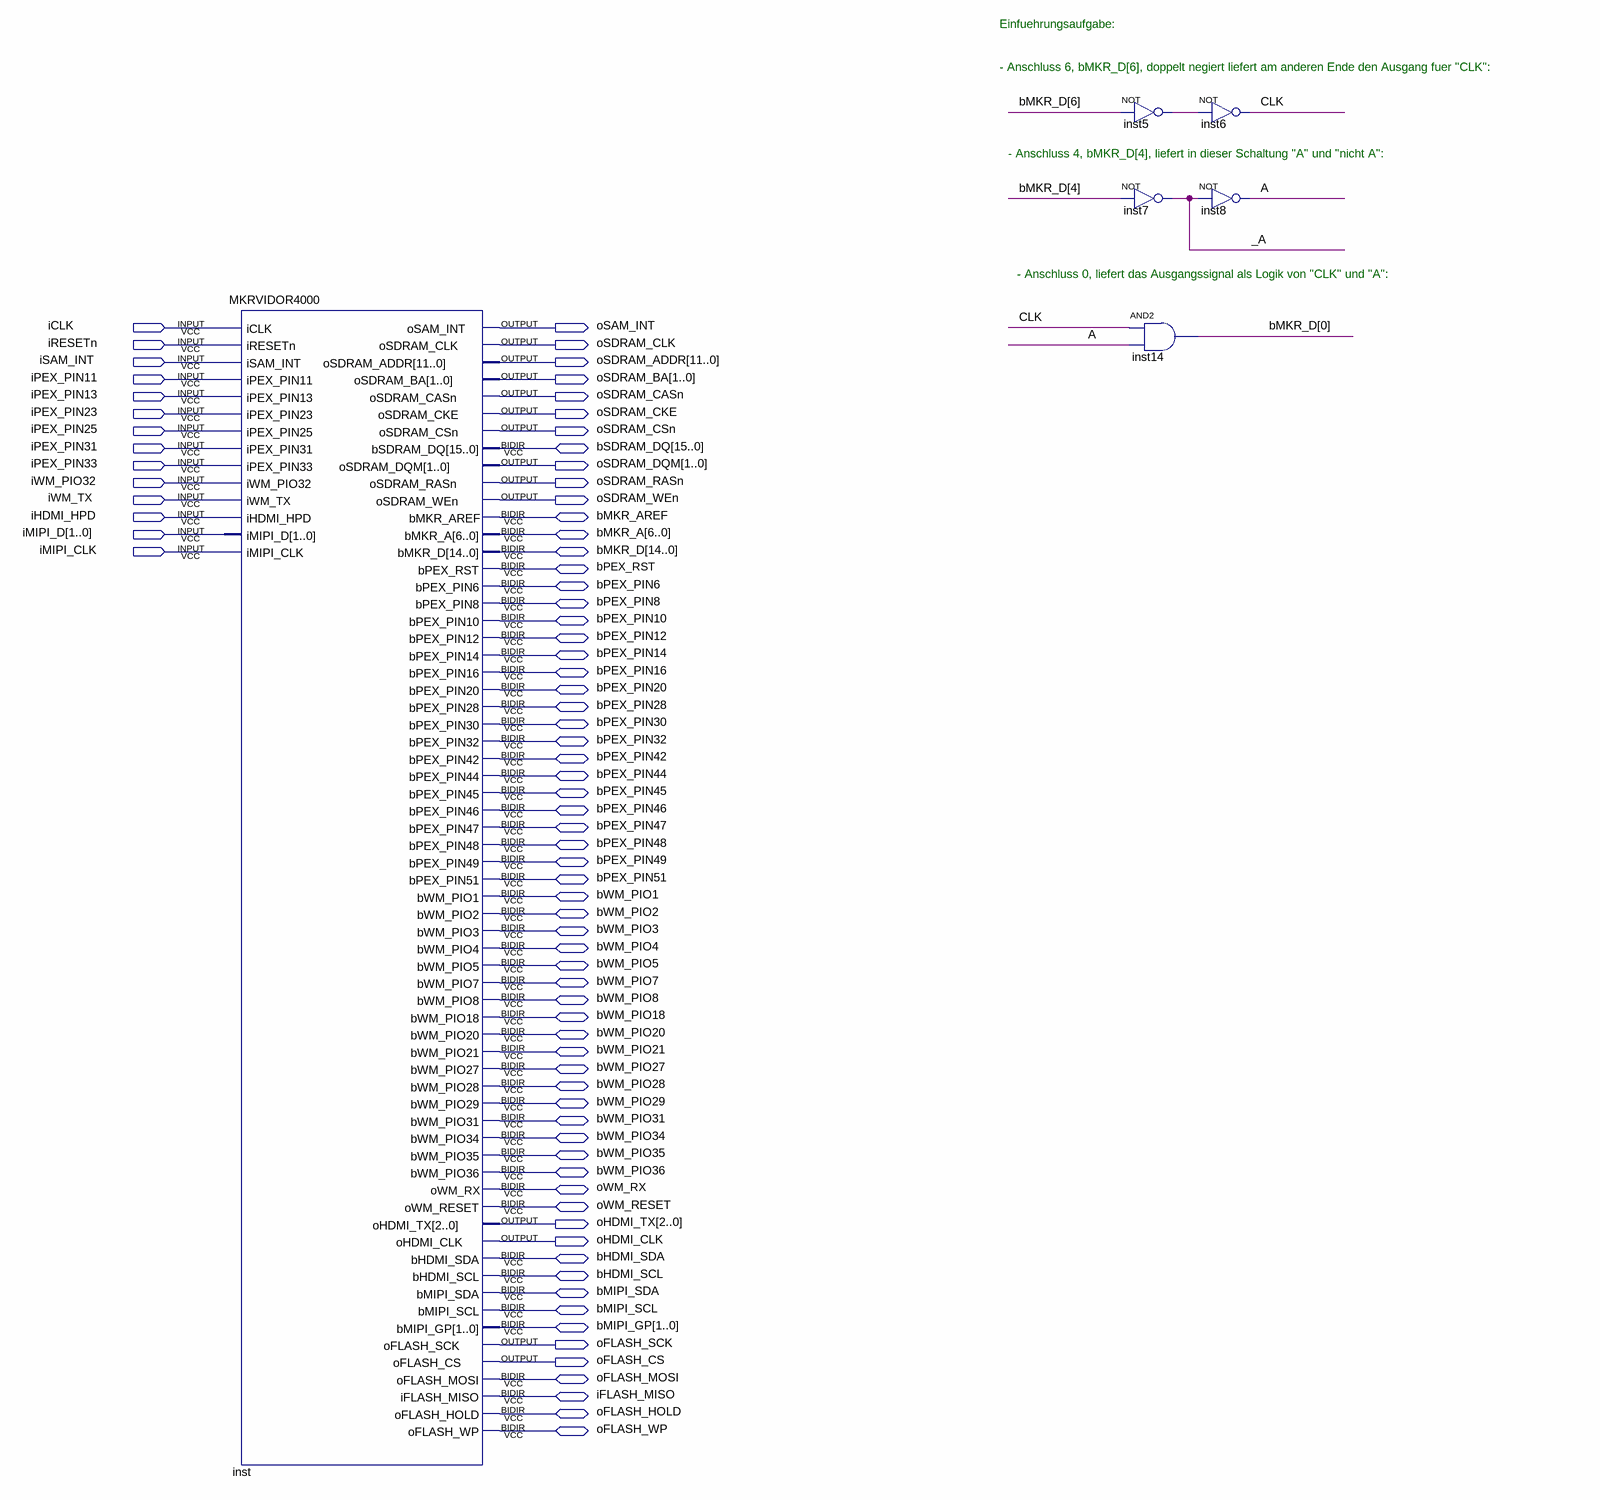
[diagram p0: schematic sheet]
// Quartus schematic FHS_DIG_Schematic.bdf as structural Verilog: 6 symbols, 79 pins
module FHS_DIG_Schematic (
  input  iCLK,
  input  iRESETn,
  input  iSAM_INT,
  input  iPEX_PIN11,
  input  iPEX_PIN13,
  input  iPEX_PIN23,
  input  iPEX_PIN25,
  input  iPEX_PIN31,
  input  iPEX_PIN33,
  input  iWM_PIO32,
  input  iWM_TX,
  input  iHDMI_HPD,
  input  [1:0] iMIPI_D,
  input  iMIPI_CLK,
  inout  [15:0] bSDRAM_DQ,
  inout  bMKR_AREF,
  inout  [6:0] bMKR_A,
  inout  [14:0] bMKR_D,
  inout  bPEX_RST,
  inout  bPEX_PIN6,
  inout  bPEX_PIN8,
  inout  bPEX_PIN10,
  inout  bPEX_PIN12,
  inout  bPEX_PIN14,
  inout  bPEX_PIN16,
  inout  bPEX_PIN20,
  inout  bPEX_PIN28,
  inout  bPEX_PIN30,
  inout  bPEX_PIN32,
  inout  bPEX_PIN42,
  inout  bPEX_PIN44,
  inout  bPEX_PIN45,
  inout  bPEX_PIN46,
  inout  bPEX_PIN47,
  inout  bPEX_PIN48,
  inout  bPEX_PIN49,
  inout  bPEX_PIN51,
  inout  bWM_PIO1,
  inout  bWM_PIO2,
  inout  bWM_PIO3,
  inout  bWM_PIO4,
  inout  bWM_PIO5,
  inout  bWM_PIO7,
  inout  bWM_PIO8,
  inout  bWM_PIO18,
  inout  bWM_PIO20,
  inout  bWM_PIO21,
  inout  bWM_PIO27,
  inout  bWM_PIO28,
  inout  bWM_PIO29,
  inout  bWM_PIO31,
  inout  bWM_PIO34,
  inout  bWM_PIO35,
  inout  bWM_PIO36,
  inout  oWM_RX,
  inout  oWM_RESET,
  inout  bHDMI_SDA,
  inout  bHDMI_SCL,
  inout  bMIPI_SDA,
  inout  bMIPI_SCL,
  inout  [1:0] bMIPI_GP,
  inout  oFLASH_MOSI,
  inout  iFLASH_MISO,
  inout  oFLASH_HOLD,
  inout  oFLASH_WP,
  output oSAM_INT,
  output oSDRAM_CLK,
  output [11:0] oSDRAM_ADDR,
  output [1:0] oSDRAM_BA,
  output oSDRAM_CASn,
  output oSDRAM_CKE,
  output oSDRAM_CSn,
  output [1:0] oSDRAM_DQM,
  output oSDRAM_RASn,
  output oSDRAM_WEn,
  output [2:0] oHDMI_TX,
  output oHDMI_CLK,
  output oFLASH_SCK,
  output oFLASH_CS
);

  wire _A, A, CLK, inst5_out;

  MKRVIDOR4000 inst (
    .iCLK(iCLK), .iRESETn(iRESETn), .iSAM_INT(iSAM_INT), .iPEX_PIN11(iPEX_PIN11), .iPEX_PIN13(iPEX_PIN13),
    .iPEX_PIN23(iPEX_PIN23), .iPEX_PIN25(iPEX_PIN25), .iPEX_PIN31(iPEX_PIN31), .iPEX_PIN33(iPEX_PIN33),
    .iWM_PIO32(iWM_PIO32), .iWM_TX(iWM_TX), .iHDMI_HPD(iHDMI_HPD), .iMIPI_D(iMIPI_D), .iMIPI_CLK(iMIPI_CLK),
    .oSAM_INT(oSAM_INT), .oSDRAM_CLK(oSDRAM_CLK), .oSDRAM_ADDR(oSDRAM_ADDR), .oSDRAM_BA(oSDRAM_BA),
    .oSDRAM_CASn(oSDRAM_CASn), .oSDRAM_CKE(oSDRAM_CKE), .oSDRAM_CSn(oSDRAM_CSn), .oSDRAM_DQM(oSDRAM_DQM),
    .oSDRAM_RASn(oSDRAM_RASn), .oSDRAM_WEn(oSDRAM_WEn), .oHDMI_TX(oHDMI_TX), .oHDMI_CLK(oHDMI_CLK),
    .oFLASH_SCK(oFLASH_SCK), .oFLASH_CS(oFLASH_CS), .bSDRAM_DQ(bSDRAM_DQ), .bMKR_AREF(bMKR_AREF),
    .bMKR_A(bMKR_A), .bMKR_D(bMKR_D), .bPEX_RST(bPEX_RST), .bPEX_PIN6(bPEX_PIN6), .bPEX_PIN8(bPEX_PIN8),
    .bPEX_PIN10(bPEX_PIN10), .bPEX_PIN12(bPEX_PIN12), .bPEX_PIN14(bPEX_PIN14), .bPEX_PIN16(bPEX_PIN16),
    .bPEX_PIN20(bPEX_PIN20), .bPEX_PIN28(bPEX_PIN28), .bPEX_PIN30(bPEX_PIN30), .bPEX_PIN32(bPEX_PIN32),
    .bPEX_PIN42(bPEX_PIN42), .bPEX_PIN44(bPEX_PIN44), .bPEX_PIN45(bPEX_PIN45), .bPEX_PIN46(bPEX_PIN46),
    .bPEX_PIN47(bPEX_PIN47), .bPEX_PIN48(bPEX_PIN48), .bPEX_PIN49(bPEX_PIN49), .bPEX_PIN51(bPEX_PIN51),
    .bWM_PIO1(bWM_PIO1), .bWM_PIO2(bWM_PIO2), .bWM_PIO3(bWM_PIO3), .bWM_PIO4(bWM_PIO4), .bWM_PIO5(bWM_PIO5),
    .bWM_PIO7(bWM_PIO7), .bWM_PIO8(bWM_PIO8), .bWM_PIO18(bWM_PIO18), .bWM_PIO20(bWM_PIO20),
    .bWM_PIO21(bWM_PIO21), .bWM_PIO27(bWM_PIO27), .bWM_PIO28(bWM_PIO28), .bWM_PIO29(bWM_PIO29),
    .bWM_PIO31(bWM_PIO31), .bWM_PIO34(bWM_PIO34), .bWM_PIO35(bWM_PIO35), .bWM_PIO36(bWM_PIO36),
    .oWM_RX(oWM_RX), .oWM_RESET(oWM_RESET), .bHDMI_SDA(bHDMI_SDA), .bHDMI_SCL(bHDMI_SCL),
    .bMIPI_SDA(bMIPI_SDA), .bMIPI_SCL(bMIPI_SCL), .bMIPI_GP(bMIPI_GP), .oFLASH_MOSI(oFLASH_MOSI),
    .iFLASH_MISO(iFLASH_MISO), .oFLASH_HOLD(oFLASH_HOLD), .oFLASH_WP(oFLASH_WP));
  not inst5 (inst5_out, bMKR_D[6]);
  not inst7 (_A, bMKR_D[4]);
  and inst14 (bMKR_D[0], CLK, A);
  not inst6 (CLK, inst5_out);
  not inst8 (A, _A);

  // Notes on the sheet:
  //   Einfuehrungsaufgabe:
  //   - Anschluss 6, bMKR_D[6], doppelt negiert liefert am anderen Ende den Ausgang fuer "CLK":
  //   - Anschluss 4, bMKR_D[4], liefert in dieser Schaltung "A" und "nicht A":
  //   - Anschluss 0, liefert das Ausgangssignal als Logik von "CLK" und "A":
endmodule
